# Altium schematic sheet MB1-Pwr-r1.0.SchDoc: Power
size A; DrawnBy: MBoard team; DocumentNumber: 4; Revision: 1.1; SheetNumber: 4; SheetTotal: 7
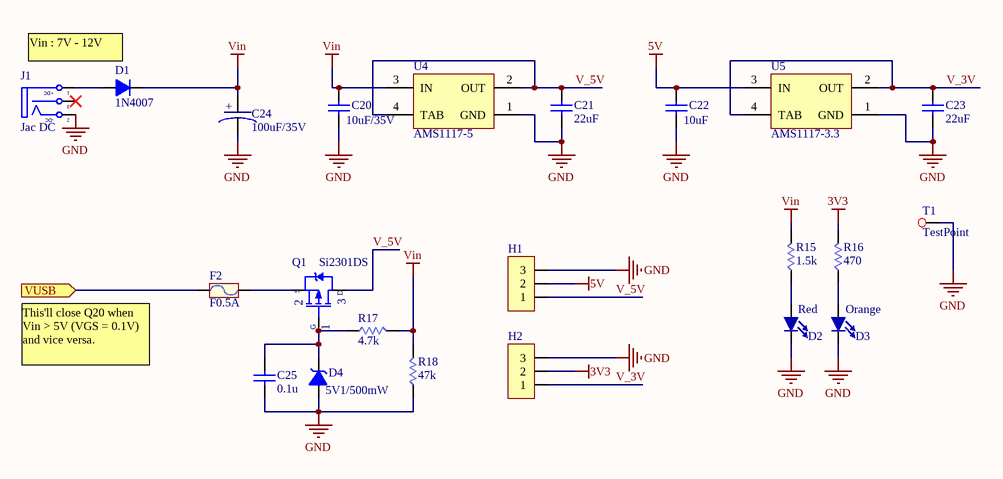
[diagram p0: MB1-Pwr-r1.0.SchDoc]

## Parts
C20  value 10uF/35V  [SM-1210]  (hidden comment: CAP Ceramic)
C21  value 22uF  [SM_0805_C_CERAMIC]  (hidden comment: CAP Ceramic)
C22  value 10uF  [SM_0805_C_CERAMIC]  (hidden comment: CAP Ceramic)
C23  value 22uF  [SM_0805_C_CERAMIC]  (hidden comment: CAP Ceramic)
C24  value 100uF/35V  [Cap-Alu-D8]  (hidden comment: CapT)
C25  value 0.1u  [SM_0805_C_CERAMIC]  (hidden comment: CAP Ceramic)
D1  1N4007  [DO-214AC]
D2  Red  [SM_0805_POL_LD]
D3  Orange  [SM_0805_POL_LD]
D4  5V1/500mW  [SOD-123]
F2  F0.5A  [SMD-1812]
H1  Hed3  [Hed3]  (value not drawn)
H2  Hed3  [Hed3]  (value not drawn)
J1  Jac DC  [DCJack]
Q1  Si2301DS  [SOT23]
R15  value 1.5k  [SM_0805_R]
R16  value 470  [SM_0805_R]
R17  value 4.7k  [SM_0805_R]
R18  value 47k  [SM_0805_R]
T1  TestPoint  [TestPoint]
U4  AMS1117-5  [MP04A_N]
U5  AMS1117-3.3  [MP04A_N]

## Ports
VUSB (in)

## Nets
3V3: H2.2 R16.2
5V: C22.2 H1.2 U5.3(IN)
GND: C20.1 C21.1 C22.1 C23.1 C24.2(-) C25.1 D2.2(K) D3.2(K) D4.1(A) H1.3 H2.3 J1.2(TN) R18.1 T1.1 U4.1(GND) U5.1(GND)
Vin: C20.2 C24.1(+) D1.2(K) R15.2 R17.2 R18.2 U4.3(IN)
V_3V: C23.2 H2.1 U5.2(OUT) U5.4(TAB)
V_5V: C21.2 H1.1 Q1.3(D) U4.2(OUT) U4.4(TAB)
VUSB: F2.1 ; port VUSB
NetC25_2: C25.2 D4.2(K) Q1.1(G) R17.1
NetD1_1: D1.1(A) J1.1(T)
NetD2_1: D2.1(A) R15.1
NetD3_1: D3.1(A) R16.1
NetF2_2: F2.2 Q1.2(S)

Not connected (* = marked no-connect by the designer): J1 3(S)*

## Notes on the sheet
- Vin : 7V - 12V
- This'll close Q20 when Vin > 5V (VGS = 0.1V) and vice versa.
- (in symbol DCIN) +DC; -DC

## Library data of the parts
C20-C23 C25 = CAP Ceramic: Non-polarity ceramic capacitor; Published: 8-Jun-2000; LatestRevisionDate: 17-Jul-2002; LatestRevisionNote: Re-released for DXP Platform.; PackageReference: RAD-0.3; Publisher: Altium Limited; PackageDescription: Radial Cap, Thru-Hole; 2 Leads; 0.3 in Pin Spacing
C24 = CapA
D1 = D1A: Diode 1A; Value: 1N4007
D2 D3 = LED: Published: 8-Jun-2000; LatestRevisionDate: 08-Jul-2005; LatestRevisionNote: Mech Layer 1 removed.; PackageReference: LED-1; Publisher: Altium Limited; PackageDescription: LED; 2 Leads
D4 = DZ: Diode Zenner; Value: 5V1/500mW
F2 = Fuse: Designed by: VanDungEvn; Value: Fuse
J1 = DCIN: Jac DC input; Value: Jac DC
Q1 = P-MOSFET: P-Channel 1.25-W, 2.5-V MOSFET
R15-R18 = R: Resistor; Published: 8-Jun-2000; LatestRevisionDate: 29-May-2009; LatestRevisionNote: IPC-7351 Footprint Added.; PackageReference: J1-0603; Publisher: Altium Limited; PackageDescription: Chip Resistor
U4 U5 = LM1117IMP-3.3: 800mA Low-Dropout Linear Regulator, 4-pin SOT-223; Manufacturer: National Semiconductor; PackageTopMarking: XYTT*N05B; PowerWise: N; CompType: LDO IC; Published: 4-Dec-2008; DatasheetVersion: Apr-2006; PackageVersion: revB, Apr-2003; PackageReference: MP04A; Publisher: Altium Limited; PackageDescription: Molded SOT-223, 6.50 x 3.56 x 1.6mm Body, 4 Lead, 2.3mm Pitch; Supplier 1: Farnell; Supplier Part Number 1: 7614123; PartNumber: LM1117IMP-3.3; RoHS: N; PinCount: 4; Code_JEDEC: TO-261-AA; Code_IPC: SOT223-4; ComponentLink1Description: LM1117 Datasheet; ComponentLink1URL: http://www.national.com/ds/LM/LM1117.pdf; ComponentLink2Description: LM1117 Web Page; ComponentLink2URL: http://www.national.com/pf/LM/LM1117.html; ComponentLink3Description: MP04A Package Page; ComponentLink3URL: http://www.national.com/packaging/folders/mp04a.html